# Altium project Variable switching regulator.PrjPCB
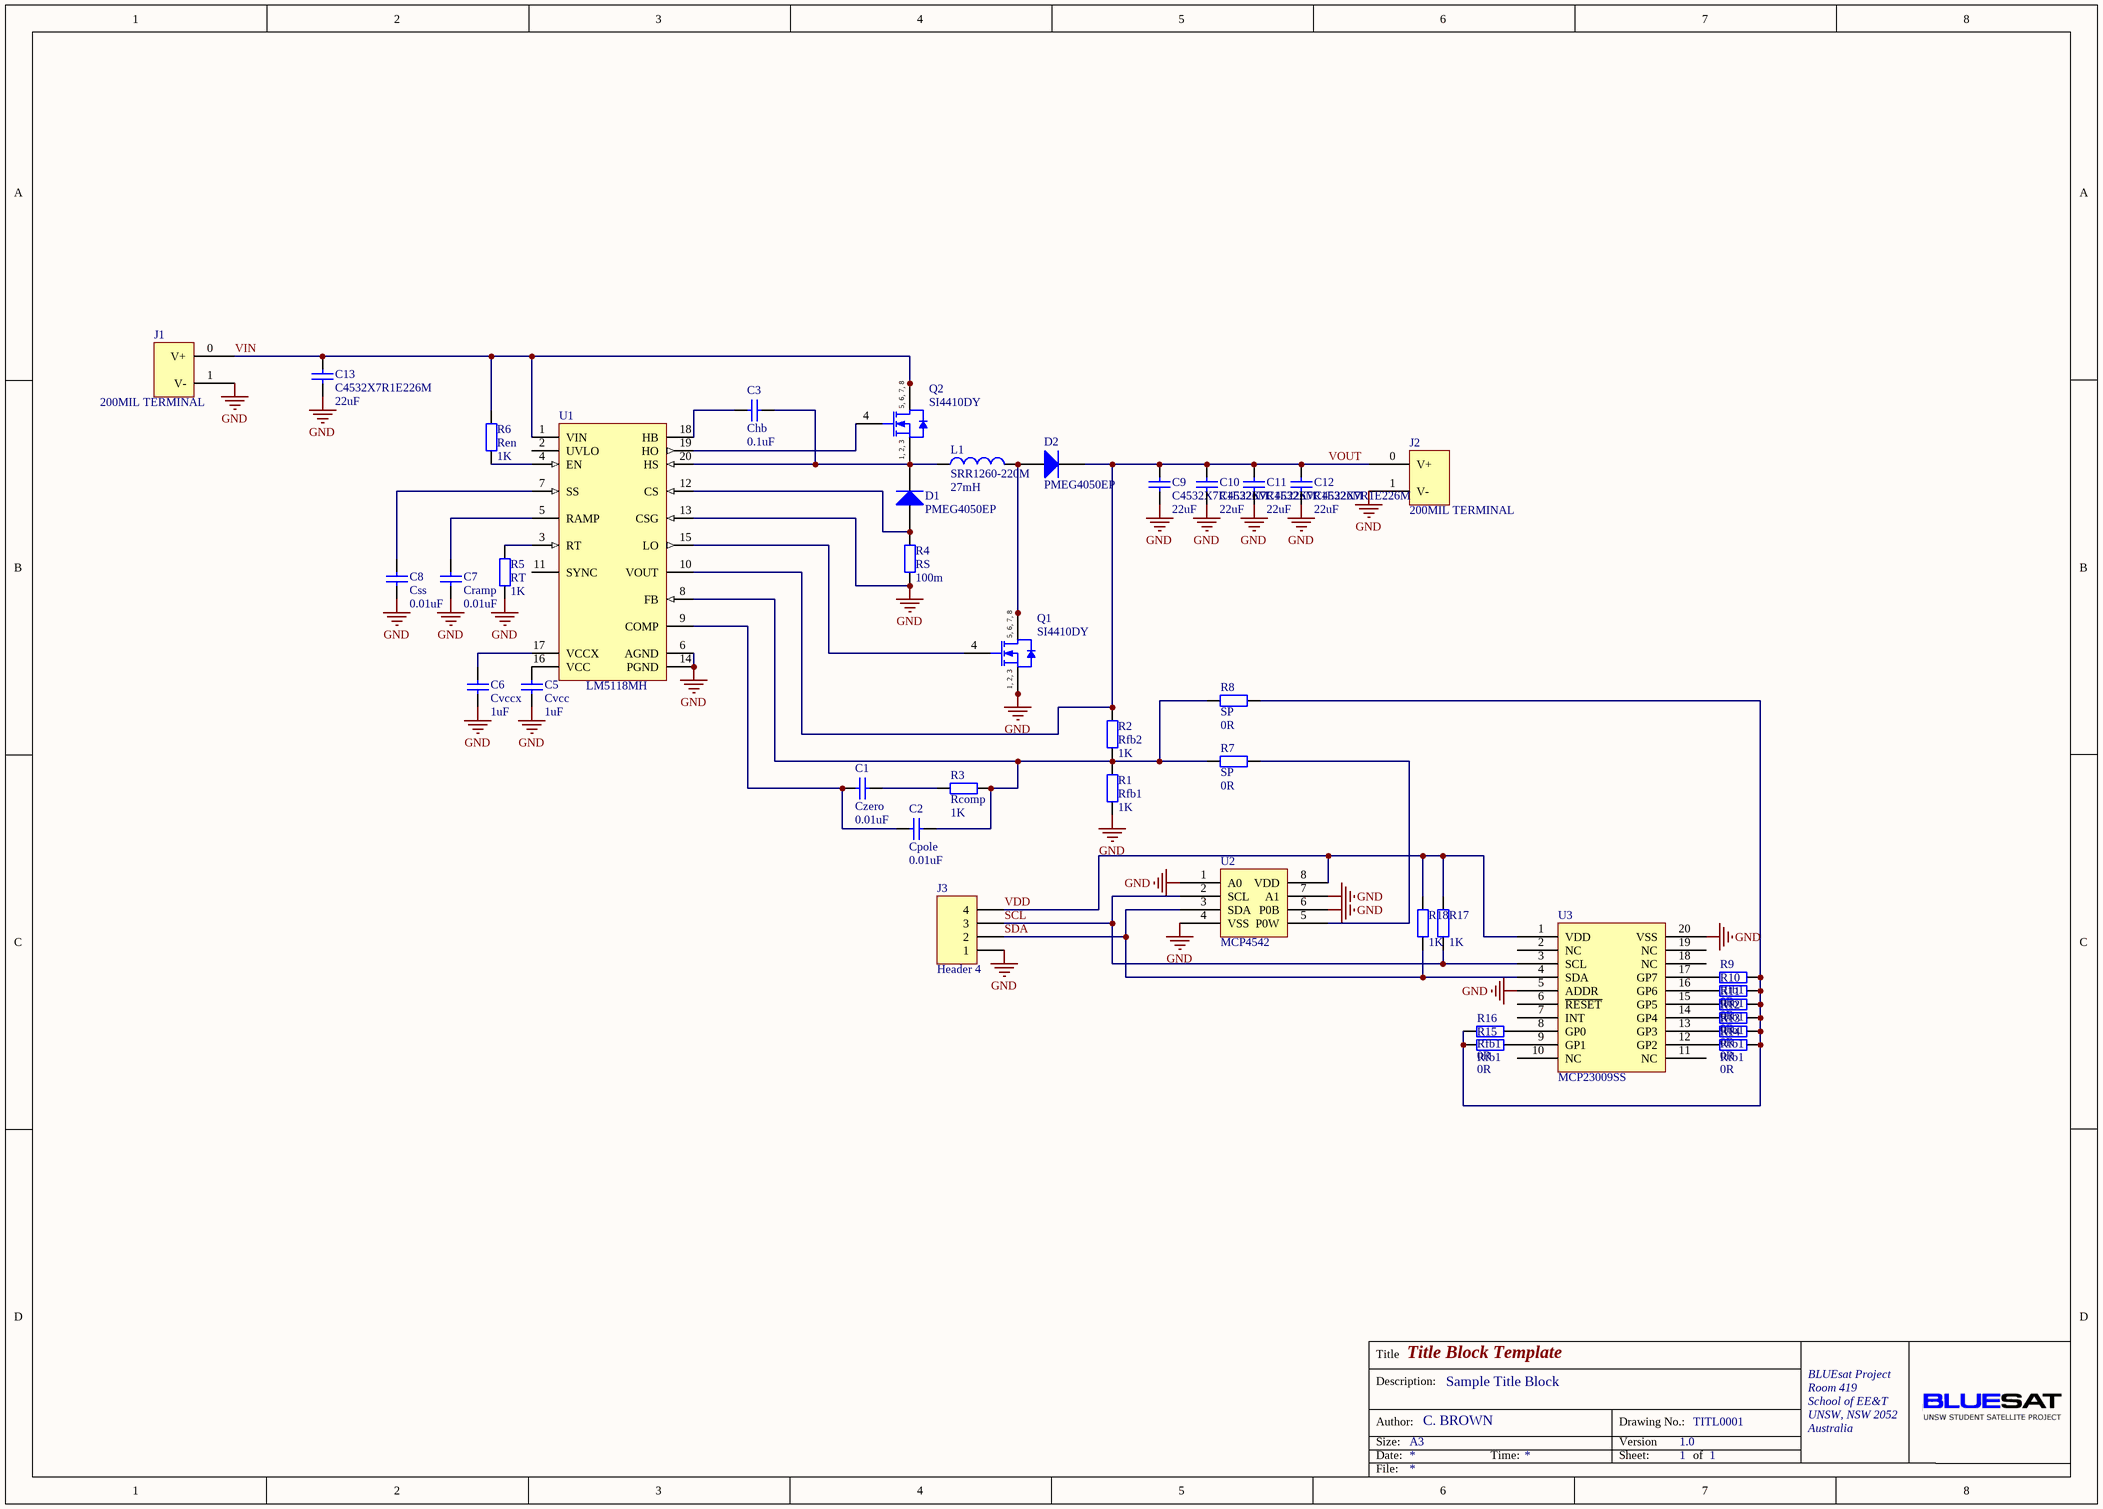
[diagram p0: V1.SchDoc]
1 sheet, 41 parts. Net scope: global (net labels, ports and power ports of the same name join across sheets).
Board file: V1.PcbDoc

## Sheet V1.SchDoc: Title Block Template
size A3; Engineer: C. BROWN; Organization: BLUEsat Project; Address1: Room 419; Address2: School of EE&T; Address3: UNSW, NSW 2052; Address4: Australia; DocumentNumber: TITL0001; SheetNumber: 1; SheetTotal: 1; Description: Sample Title Block; Version: 1.0

### Parts
C1  Czero  value 0.01uF  [R0805M]
C2  Cpole  value 0.01uF  [R0805M]
C3  Chb  value 0.1uF  [R0805M]
C5  Cvcc  value 1uF  [R0805M]
C6  Cvccx  value 1uF  [R0805M]
C7  Cramp  value 0.01uF  [R0805M]
C8  Css  value 0.01uF  [R0805M]
C9  C4532X7R1E226M  value 22uF  [R1812M]
C10  C4532X7R1E226M  value 22uF  [R1812M]
C11  C4532X7R1E226M  value 22uF  [R1812M]
C12  C4532X7R1E226M  value 22uF  [R1812M]
C13  C4532X7R1E226M  value 22uF  [R1812M]
D1  PMEG4050EP  [SOD128M]
D2  PMEG4050EP  [SOD128M]
J1  200MIL TERMINAL  [200MIL TERMINAL]
J2  200MIL TERMINAL  [200MIL TERMINAL]
J3  Header 4  [HDR1X4]
L1  SRR1260-220M  value 27mH  [SRR1260M]
Q1  SI4410DY  [SO-8_N]
Q2  SI4410DY  [SO-8_N]
R1  Rfb1  value 1K  [R0805M]
R2  Rfb2  value 1K  [R0805M]
R3  Rcomp  value 1K  [R0805M]
R4  RS  value 100m  [R0805M]
R5  RT  value 1K  [R0805M]
R6  Ren  value 1K  [R0805M]
R7  SP  value 0R  [R0805M]
R8  SP  value 0R  [R0805M]
R9  Rfb1  value 0R  [R0805M]
R10  Rfb1  value 0R  [R0805M]
R11  Rfb1  value 0R  [R0805M]
R12  Rfb1  value 0R  [R0805M]
R13  Rfb1  value 0R  [R0805M]
R14  Rfb1  value 0R  [R0805M]
R15  Rfb1  value 0R  [R0805M]
R16  Rfb1  value 0R  [R0805M]
R17  value 1K  [R0805M]
R18  value 1K  [R0805M]
U1  LM5118MH  [MXA20A_N]
U2  MCP4542  [MSOP8]
U3  MCP23009SS  [SSOP20_M]

### Nets
GND: C5.1 C6.1 C7.1 C8.1 C9.1 C10.1 C11.1 C12.1 C13.1 J1.1(V-) J2.1(V-) J3.1 Q1.1(S) Q1.2(S) Q1.3(S) R1.1 R4.1 R5.1 U1.6(AGND) U1.13(CSG) U1.14(PGND) U2.1(A0) U2.4(VSS) U2.6(P0B) U2.7(A1) U3.5(ADDR) U3.20(VSS)
SCL: J3.3 R17.1 U2.2(SCL) U3.3(SCL)
SDA: J3.2 R18.1 U2.3(SDA) U3.4(SDA)
VDD: J3.4 R17.2 R18.2 U2.8(VDD) U3.1(VDD)
VIN: C13.2 J1.0(V+) Q2.5(D) Q2.6(D) Q2.7(D) Q2.8(D) R6.2 U1.1(VIN)
VOUT: C9.2 C10.2 C11.2 C12.2 D2.2(K) J2.0(V+) R2.2 U1.10(VOUT)
NetC1_1: C1.1 C2.1 U1.9(COMP)
NetC1_2: C1.2 R3.1
NetC2_2: C2.2 R1.2 R2.1 R3.2 R7.2 R8.2 U1.8(FB)
NetC3_1: C3.1 U1.18(HB)
NetC3_2: C3.2 D1.2(K) L1.1 Q2.1(S) Q2.2(S) Q2.3(S) U1.20(HS)
NetC5_2: C5.2 U1.16(VCC)
NetC6_2: C6.2 U1.17(VCCX)
NetC7_2: C7.2 U1.5(RAMP)
NetC8_2: C8.2 U1.7(SS)
NetD1_1: D1.1(A) R4.2 U1.12(CS)
NetD2_1: D2.1(A) L1.2 Q1.5(D) Q1.6(D) Q1.7(D) Q1.8(D)
NetQ1_4: Q1.4(G) U1.15(LO)
NetQ2_4: Q2.4(G) U1.19(HO)
NetR5_2: R5.2 U1.3(RT)
NetR6_1: R6.1 U1.4(EN)
NetR7_1: R7.1 U2.5(P0W)
NetR8_1: R8.1 R9.1 R10.1 R11.1 R12.1 R13.1 R14.1 R15.2 R16.2
NetR9_2: R9.2 U3.17(GP7)
NetR10_2: R10.2 U3.16(GP6)
NetR11_2: R11.2 U3.15(GP5)
NetR12_2: R12.2 U3.14(GP4)
NetR13_2: R13.2 U3.13(GP3)
NetR14_2: R14.2 U3.12(GP2)
NetR15_1: R15.1 U3.9(GP1)
NetR16_1: R16.1 U3.8(GP0)

Not connected (* = marked no-connect by the designer): U1 2(UVLO) 11(SYNC); U3 2(NC) 6(~{RESET}) 7(INT) 10(NC) 11(NC) 18(NC) 19(NC)

### Notes on the sheet
- Title
- Description:
- Size:
- Author:
- Date:
- A3
- Time:
- Version
- Sheet:
- Drawing No.:
- of
- File:
- (in symbol SI4410DY) 5, 6, 7, 8; 1, 2, 3

### Library data of the parts
C1-C3 C5-C13 = Cap: Capacitor; Published: 8-Jun-2000; LatestRevisionDate: 17-Jul-2002; LatestRevisionNote: Re-released for DXP Platform.; PackageReference: RAD-0.3; Publisher: Altium Limited
D1 D2 = Diode: Default Diode; Published: 8-Jun-2000; LatestRevisionDate: 17-Jul-2002; LatestRevisionNote: Re-released for DXP Platform.; PackageVersion: Sep-1996; PackageReference: SMC; Publisher: Altium Limited; Code_JEDEC: DO-214-AB
J3 = Header 4: Header, 4-Pin; LatestRevisionDate: 17-Jul-2002; LatestRevisionNote: Re-released for DXP Platform.; Publisher: Altium Limited
L1 = Inductor: Code_IEC: 1005; Published: 8-Jun-2000; LatestRevisionDate: 29-May-2009; LatestRevisionNote: IPC-7351 Footprint Added.; PackageReference: 0402-A; Publisher: Altium Limited; PackageDescription: Chip Inductor; Code_JEITA: 0402
Q1 Q2 = SI4410DY: N-Channel 30V (D-S)  MOSFET; Published: 8-Jun-2000; LatestRevisionDate: 13-Apr-2006; LatestRevisionNote: IPC-7351 Footprint Added.; DatasheetVersion: 23-Nov-1998; PackageVersion: Aug-1998; PackageReference: SO-8; Publisher: Altium Limited; PackageDescription: 8-Pin Small Outline Integrated Circuit 1.27 mm Pitch; ComponentLink1Description: Manufacturer Link; ComponentLink1URL: http://www.vishay.com/; ComponentLink2Description: Datasheet; ComponentLink2URL: http://www.vishay.com/docs/71726/71726.pdf
R1-R18 = Res2: Resistor; Published: 8-Jun-2000; LatestRevisionDate: 17-Jul-2002; LatestRevisionNote: Re-released for DXP Platform.; PackageReference: AXIAL-0.4; Publisher: Altium Limited
U1 = LM5118MH: Wide Voltage Range Buck-Boost Controller; Manufacturer: National Semiconductor; CompType: Switcher; PackageTopMarking: NSUZXYTT*LM5118*MH; PowerWise: Y; Published: 4-Dec-2008; DatasheetVersion: May-2008; PackageVersion: revC, Jul-2006; PackageReference: MXA20A; Publisher: Altium Limited; PackageDescription: Molded TSSOP, Jedec, 6.5 x 4.4 x 0.9mm Body, 20 Lead, 0.65mm Pitch, Exposed Pad; PartNumber: LM5118MH; RoHS: Y; PinCount: 20; DigiKeyPartNumber: LM5118MH-ND; Code_JEDEC: MO-153-ACT; ComponentLink1Description: LM5118 Datasheet; ComponentLink1URL: http://www.national.com/ds/LM/LM5118.pdf; ComponentLink2Description: LM5118 Web Page; ComponentLink2URL: http://www.national.com/pf/LM/LM5118.html; ComponentLink3Description: MXA20A Package Drawing; ComponentLink3URL: http://www.national.com/packaging/folders/mxa20a.html